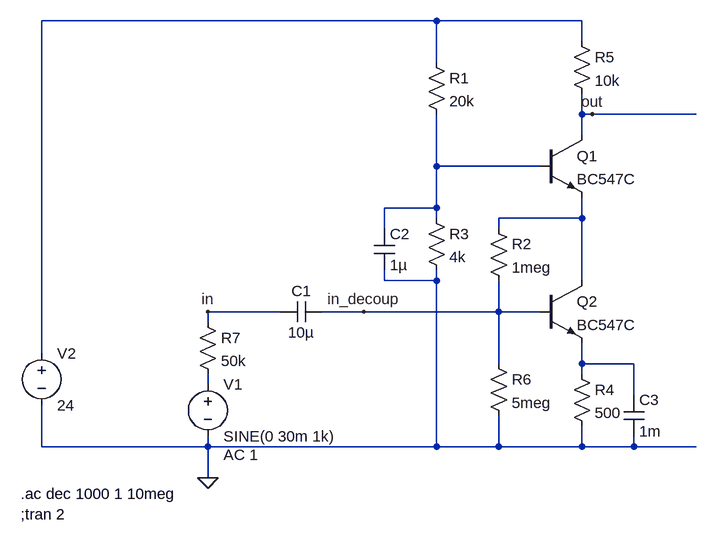
[diagram p0: schematic amp_labor2_2npn_2.asc]
amp_labor2_2npn_2.asc, the LTspice schematic file:
Version 4
SHEET 1 880 936
WIRE 112 160 -496 160
WIRE 336 160 112 160
WIRE 336 192 336 160
WIRE 112 224 112 160
WIRE 336 304 336 272
WIRE 352 304 336 304
WIRE 432 304 352 304
WIRE 512 304 432 304
WIRE 336 336 336 304
WIRE 112 384 112 304
WIRE 192 384 112 384
WIRE 272 384 192 384
WIRE 112 448 112 384
WIRE 112 448 32 448
WIRE 112 464 112 448
WIRE 336 464 336 432
WIRE 336 464 208 464
WIRE 32 480 32 448
WIRE 208 480 208 464
WIRE 336 480 336 464
WIRE 32 560 32 544
WIRE 112 560 112 544
WIRE 112 560 32 560
WIRE 336 560 336 480
WIRE -128 608 -240 608
WIRE 0 608 -64 608
WIRE 144 608 0 608
WIRE 208 608 208 560
WIRE 208 608 144 608
WIRE 272 608 208 608
WIRE -240 624 -240 608
WIRE -496 672 -496 160
WIRE 208 688 208 608
WIRE 336 688 336 656
WIRE 416 688 336 688
WIRE 336 704 336 688
WIRE -240 720 -240 704
WIRE 416 736 416 688
WIRE -496 816 -496 752
WIRE -240 816 -240 800
WIRE -240 816 -496 816
WIRE 112 816 112 560
WIRE 112 816 -240 816
WIRE 208 816 208 768
WIRE 208 816 112 816
WIRE 336 816 336 784
WIRE 336 816 208 816
WIRE 416 816 416 800
WIRE 416 816 336 816
WIRE 512 816 416 816
WIRE -240 864 -240 816
FLAG -240 864 0
FLAG 352 304 out
FLAG -240 608 in
FLAG 0 608 in_decoup
DATAFLAG 432 304 ""
DATAFLAG 144 608 ""
DATAFLAG 336 480 ""
DATAFLAG 192 384 ""
SYMBOL res 320 688 R0
SYMATTR InstName R4
SYMATTR Value 500
SYMBOL res 320 176 R0
SYMATTR InstName R5
SYMATTR Value 10k
SYMBOL cap -64 592 R90
WINDOW 0 0 32 VBottom 2
WINDOW 3 32 32 VTop 2
SYMATTR InstName C1
SYMATTR Value 10µ
SYMBOL voltage -240 704 R0
WINDOW 123 24 124 Left 2
WINDOW 39 0 0 Left 2
SYMATTR Value2 AC 1
SYMATTR InstName V1
SYMATTR Value SINE(0 30m 1k)
SYMBOL voltage -496 656 R0
WINDOW 123 0 0 Left 2
WINDOW 39 0 0 Left 2
SYMATTR InstName V2
SYMATTR Value 24
SYMBOL res -256 608 R0
SYMATTR InstName R7
SYMATTR Value 50k
SYMBOL res 96 208 R0
SYMATTR InstName R1
SYMATTR Value 20k
SYMBOL res 192 464 R0
SYMATTR InstName R2
SYMATTR Value 1meg
SYMBOL res 96 448 R0
SYMATTR InstName R3
SYMATTR Value 4k
SYMBOL npn 272 336 R0
SYMATTR InstName Q1
SYMATTR Value BC547C
SYMBOL npn 272 560 R0
SYMATTR InstName Q2
SYMATTR Value BC547C
SYMBOL cap 16 480 R0
SYMATTR InstName C2
SYMATTR Value 1µ
SYMBOL res 192 672 R0
SYMATTR InstName R6
SYMATTR Value 5meg
SYMBOL cap 400 736 R0
SYMATTR InstName C3
SYMATTR Value 1m
TEXT -528 888 Left 2 !.ac dec 1000 1 10meg
TEXT -528 920 Left 2 !;tran 2

The netlist it stands for:
* amp_labor2_2npn_2.asc
R4 N004 0 500
R5 N001 out 10k
C1 in_decoup in 10µ
V1 N005 0 SINE(0 30m 1k) AC 1
V2 N001 0 24
R7 in N005 50k
R1 N001 N002 20k
R2 N003 in_decoup 1meg
R3 N002 0 4k
Q1 out N002 N003 0 BC547C
Q2 N003 in_decoup N004 0 BC547C
C2 N002 0 1µ
R6 in_decoup 0 5meg
C3 N004 0 1m
.model NPN NPN
.model PNP PNP
.lib standard.bjt
.ac dec 1000 1 10meg
;tran 2
.backanno
.end